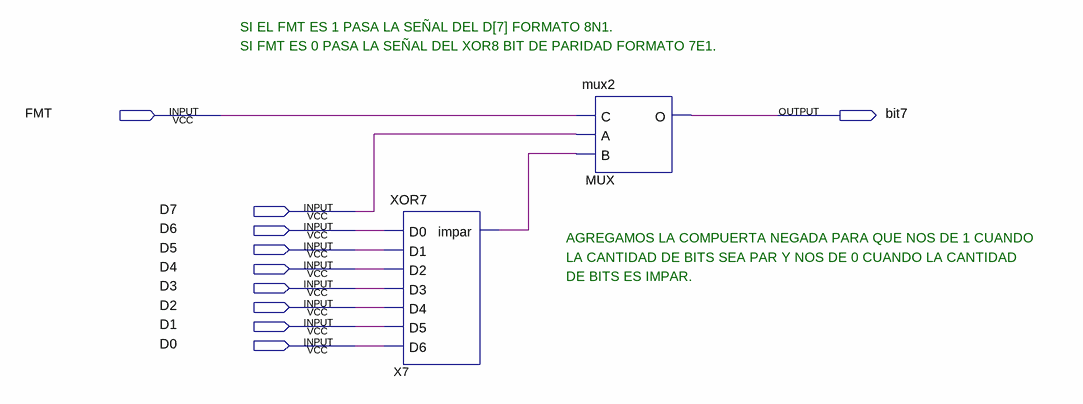
[diagram p0: schematic sheet]
// Quartus schematic Selector.bdf as structural Verilog: 2 symbols, 10 pins
module Selector (
  input  FMT,
  input  D7,
  input  D6,
  input  D5,
  input  D4,
  input  D3,
  input  D2,
  input  D1,
  input  D0,
  output bit7
);

  wire X7_impar;

  XOR7 X7 (.D0(D6), .D1(D5), .D2(D4), .D3(D3), .D4(D2), .D5(D1), .D6(D0), .impar(X7_impar));
  mux2 MUX (.C(FMT), .A(D7), .B(X7_impar), .O(bit7));

  // Notes on the sheet:
  //   SI EL FMT ES 1 PASA LA SEÑAL DEL D[7] FORMATO 8N1.
  //   SI FMT ES 0 PASA LA SEÑAL DEL XOR8 BIT DE PARIDAD FORMATO 7E1.
  //   AGREGAMOS LA COMPUERTA NEGADA PARA QUE NOS DE 1 CUANDO
  //   LA CANTIDAD DE BITS SEA PAR Y NOS DE 0 CUANDO LA CANTIDAD 
  //   DE BITS ES IMPAR.
endmodule
